# Altium schematic sheet PCB_Controller.SchDoc
size A3; DocumentNumber: 8; SheetNumber: 8; SheetTotal: 8
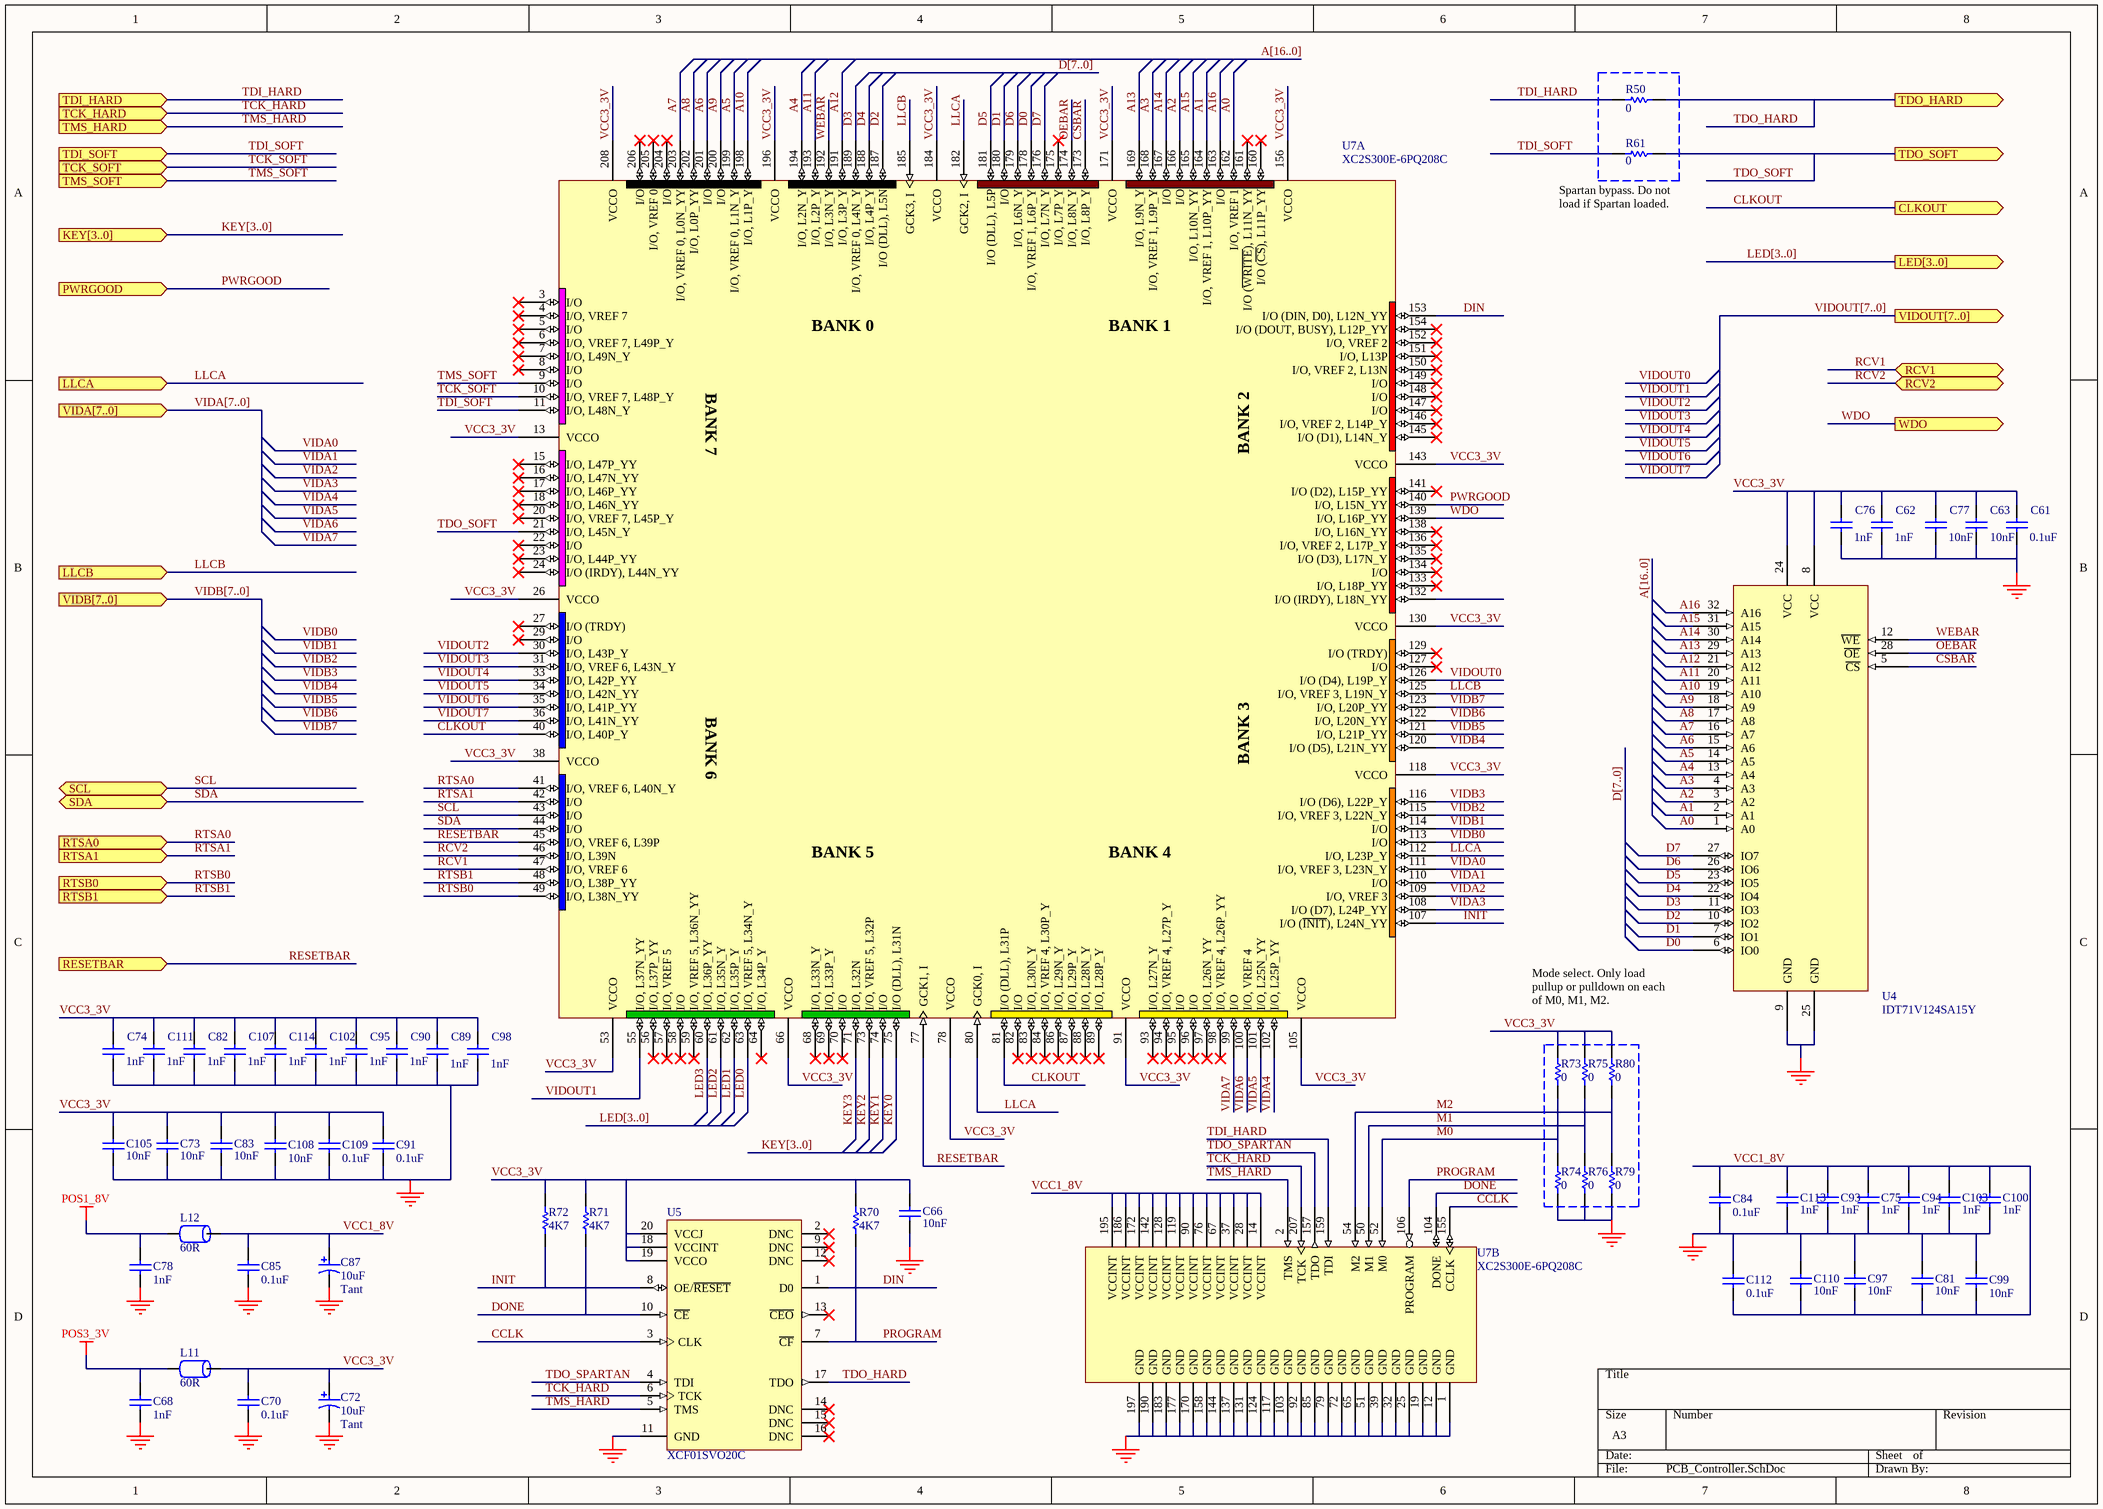
[diagram p0: PCB_Controller.SchDoc]

## Parts
C61  0.1uF  [CC2012-0805]
C62  1nF  [CC2012-0805]
C63  10nF  [CC2012-0805]
C66  10nF  [CC2012-0805]
C68  1nF  [CC2012-0805]
C70  0.1uF  [CC2012-0805]
C72  10uF  Capacitor Type: Tant  [MCCT-B]
C73  10nF  [CC2012-0805]
C74  1nF  [CC2012-0805]
C75  1nF  [CC2012-0805]
C76  1nF  [CC2012-0805]
C77  10nF  [CC2012-0805]
C78  1nF  [CC2012-0805]
C81  10nF  [CC2012-0805]
C82  1nF  [CC2012-0805]
C83  10nF  [CC2012-0805]
C84  0.1uF  [CC2012-0805]
C85  0.1uF  [CC2012-0805]
C87  10uF  Capacitor Type: Tant  [MCCT-B]
C89  1nF  [CC2012-0805]
C90  1nF  [CC2012-0805]
C91  0.1uF  [CC2012-0805]
C93  1nF  [CC2012-0805]
C94  1nF  [CC2012-0805]
C95  1nF  [CC2012-0805]
C97  10nF  [CC2012-0805]
C98  1nF  [CC2012-0805]
C99  10nF  [CC2012-0805]
C100  1nF  [CC2012-0805]
C102  1nF  [CC2012-0805]
C103  1nF  [CC2012-0805]
C105  10nF  [CC2012-0805]
C107  1nF  [CC2012-0805]
C108  10nF  [CC2012-0805]
C109  0.1uF  [CC2012-0805]
C110  10nF  [CC2012-0805]
C111  1nF  [CC2012-0805]
C112  0.1uF  [CC2012-0805]
C113  1nF  [CC2012-0805]
C114  1nF  [CC2012-0805]
L11  60R  [CC2012-0805]
L12  60R  [CC2012-0805]
R50  0  [CC2012-0805]
R61  0  [CC2012-0805]
R70  4K7  [CC2012-0805]
R71  4K7  [CC2012-0805]
R72  4K7  [CC2012-0805]
R73  0  [CC2012-0805]
R74  0  [CC2012-0805]
R75  0  [CC2012-0805]
R76  0  [CC2012-0805]
R79  0  [CC2012-0805]
R80  0  [CC2012-0805]
U4  IDT71V124SA15Y  [SO-J32]
U5  XCF01SVO20C  [VO20]
U7  XC2S300E-6PQ208C  [F-QFP28X28-G208/P.5N]  (parts A,B of 2)

## Ports
CLKOUT (out), KEY[3..0] (in), LED[3..0] (out), LLCA (in), LLCB (in), PWRGOOD (in), RCV1 (bidir), RCV2 (bidir), RESETBAR (in), RTSA0 (in), RTSA1 (in), RTSB0 (in), RTSB1 (in), SCL (bidir), SDA (bidir), TCK_HARD (in), TCK_SOFT (in), TDI_HARD (in), TDI_SOFT (in), TDO_HARD (out), TDO_SOFT (out), TMS_HARD (in), TMS_SOFT (in), VIDA[7..0] (in), VIDB[7..0] (in), VIDOUT[7..0] (out), WDO (out)

## Nets
GND: C61.2 C62.2 C63.2 C66.2 C68.2 C70.2 C72.2 C73.2 C74.2 C75.2 C76.2 C77.2 C78.2 C81.1 C82.2 C83.2 C84.2 C85.2 C87.2 C89.2 C90.2 C91.2 C93.2 C94.2 C95.2 C97.1 C98.2 C99.1 C100.2 C102.2 C103.2 C105.2 C107.2 C108.2 C109.2 C110.1 C111.2 C112.1 C113.2 C114.2 R74.2 R76.2 R79.2 U4.9(GND) U4.25(GND) U5.11(GND) U7.1(GND) U7.12(GND) U7.19(GND) U7.25(GND) U7.32(GND) U7.39(GND) U7.51(GND) U7.65(GND) U7.72(GND) U7.79(GND) U7.85(GND) U7.92(GND) U7.103(GND) U7.117(GND) U7.124(GND) U7.131(GND) U7.137(GND) U7.144(GND) U7.158(GND) U7.170(GND) U7.177(GND) U7.183(GND) U7.190(GND) U7.197(GND)
POS1_8V: C78.1 L12.1
POS3_3V: C68.1 L11.1
A0: U4.1(A0) U7.162(I/O,_VREF_1)
A1: U4.2(A1) U7.164(I/O,_VREF_1,_L10P_YY)
A2: U4.3(A2) U7.166(I/O)
A3: U4.4(A3) U7.168(I/O,_VREF_1,_L9P_Y)
A4: U4.13(A4) U7.194(I/O,_L2N_Y)
A5: U4.14(A5) U7.199(I/O,_VREF_0,_L1N_Y)
A6: U4.15(A6) U7.201(I/O)
A7: U4.16(A7) U7.203(I/O,_VREF_0,_L0N_YY)
A8: U4.17(A8) U7.202(I/O,_L0P_YY)
A9: U4.18(A9) U7.200(I/O)
A10: U4.19(A10) U7.198(I/O,_L1P_Y)
A11: U4.20(A11) U7.193(I/O,_L2P_Y)
A12: U4.21(A12) U7.191(I/O,_L3P_Y)
A13: U4.29(A13) U7.169(I/O,_L9N_Y)
A14: U4.30(A14) U7.167(I/O)
A15: U4.31(A15) U7.165(I/O,_L10N_YY)
A16: U4.32(A16) U7.163(I/O)
CCLK: U5.3(CLK) U7.155(CCLK)
CLKOUT: U7.40(I/O,_L40P_Y) U7.81(I/O_(DLL),_L31P) ; port CLKOUT
CSBAR: U4.5(~{CS}) U7.173(I/O,_L8P_Y)
D0: U4.6(IO0) U7.178(I/O,_VREF_1,_L6P_Y)
D1: U4.7(IO1) U7.180(I/O)
D2: U4.10(IO2) U7.187(I/O_(DLL),_L5N)
D3: U4.11(IO3) U7.189(I/O,_VREF_0,_L4N_Y)
D4: U4.22(IO4) U7.188(I/O,_L4P_Y)
D5: U4.23(IO5) U7.181(I/O_(DLL),_L5P)
D6: U4.26(IO6) U7.179(I/O,_L6N_Y)
D7: U4.27(IO7) U7.176(I/O,_L7N_Y)
DIN: U5.1(D0) U7.153(I/O_(DIN,_D0),_L12N_YY)
DONE: R71.2 U5.10(~{CE}) U7.104(DONE)
INIT: R72.2 U5.8(OE/~{RESET}) U7.107(I/O_(~{INIT}),_L24N_YY)
KEY0: U7.75(I/O_(DLL),_L31N)
KEY1: U7.74(I/O)
KEY2: U7.73(I/O,_VREF_5,_L32P)
KEY3: U7.71(I/O,_L32N)
LED0: U7.63(I/O,_VREF_5,_L34N_Y)
LED1: U7.62(I/O,_L35P_Y)
LED2: U7.61(I/O,_L35N_Y)
LED3: U7.60(I/O,_L36P_YY)
LLCA: U7.80(GCK0,_I) U7.112(I/O,_L23P_Y) U7.182(GCK2,_I) ; port LLCA
LLCB: U7.125(I/O,_VREF_3,_L19N_Y) U7.185(GCK3,_I) ; port LLCB
M0: R73.2 R74.1 U7.52(M0)
M1: R75.2 R76.1 U7.50(M1)
M2: R79.1 R80.2 U7.54(M2)
OEBAR: U4.28(~{OE}) U7.174(I/O,_L8N_Y)
PROGRAM: R70.2 U5.7(~{CF}) U7.106(PROGRAM)
PWRGOOD: U7.140(I/O,_L15N_YY) ; port PWRGOOD
RCV1: U7.47(I/O,_VREF_6) ; port RCV1
RCV2: U7.46(I/O,_L39N) ; port RCV2
RESETBAR: U7.45(I/O,_VREF_6,_L39P) U7.77(GCK1,_I) ; port RESETBAR
RTSA0: U7.41(I/O,_VREF_6,_L40N_Y) ; port RTSA0
RTSA1: U7.42(I/O) ; port RTSA1
RTSB0: U7.49(I/O,_L38N_YY) ; port RTSB0
RTSB1: U7.48(I/O,_L38P_YY) ; port RTSB1
SCL: U7.43(I/O) ; port SCL
SDA: U7.44(I/O) ; port SDA
TCK_HARD: U5.6(TCK) U7.207(TCK) ; port TCK_HARD
TCK_SOFT: U7.10(I/O,_VREF_7,_L48P_Y) ; port TCK_SOFT
TDI_HARD: R50.1 U7.159(TDI) ; port TDI_HARD
TDI_SOFT: R61.1 U7.11(I/O,_L48N_Y) ; port TDI_SOFT
TDO_HARD: R50.2 U5.17(TDO) ; port TDO_HARD
TDO_SOFT: R61.2 U7.21(I/O,_L45N_Y) ; port TDO_SOFT
TDO_SPARTAN: U5.4(TDI) U7.157(TDO)
TMS_HARD: U5.5(TMS) U7.2(TMS) ; port TMS_HARD
TMS_SOFT: U7.9(I/O) ; port TMS_SOFT
VCC1_8V: C75.1 C81.2 C84.1 C85.1 C87.1 C93.1 C94.1 C97.2 C99.2 C100.1 C103.1 C110.2 C112.2 C113.1 L12.2 U7.14(VCCINT) U7.28(VCCINT) U7.37(VCCINT) U7.67(VCCINT) U7.76(VCCINT) U7.90(VCCINT) U7.119(VCCINT) U7.128(VCCINT) U7.142(VCCINT) U7.172(VCCINT) U7.186(VCCINT) U7.195(VCCINT)
VCC3_3V: C61.1 C62.1 C63.1 C66.1 C70.1 C72.1 C73.1 C74.1 C76.1 C77.1 C82.1 C83.1 C89.1 C90.1 C91.1 C95.1 C98.1 C102.1 C105.1 C107.1 C108.1 C109.1 C111.1 C114.1 L11.2 R70.1 R71.1 R72.1 R73.1 R75.1 R80.1 U4.8(VCC) U4.24(VCC) U5.18(VCCINT) U5.19(VCCO) U5.20(VCCJ) U7.13(VCCO) U7.26(VCCO) U7.38(VCCO) U7.53(VCCO) U7.66(VCCO) U7.78(VCCO) U7.91(VCCO) U7.105(VCCO) U7.118(VCCO) U7.130(VCCO) U7.143(VCCO) U7.156(VCCO) U7.171(VCCO) U7.184(VCCO) U7.196(VCCO) U7.208(VCCO)
VIDA0: U7.111(I/O,_VREF_3,_L23N_Y)
VIDA1: U7.110(I/O)
VIDA2: U7.109(I/O,_VREF_3)
VIDA3: U7.108(I/O_(D7),_L24P_YY)
VIDA4: U7.102(I/O,_L25P_YY)
VIDA5: U7.101(I/O,_L25N_YY)
VIDA6: U7.100(I/O,_VREF_4)
VIDA7: U7.99(I/O)
VIDB0: U7.113(I/O)
VIDB1: U7.114(I/O)
VIDB2: U7.115(I/O,_VREF_3,_L22N_Y)
VIDB3: U7.116(I/O_(D6),_L22P_Y)
VIDB4: U7.120(I/O_(D5),_L21N_YY)
VIDB5: U7.121(I/O,_L21P_YY)
VIDB6: U7.122(I/O,_L20N_YY)
VIDB7: U7.123(I/O,_L20P_YY)
VIDOUT0: U7.126(I/O_(D4),_L19P_Y)
VIDOUT1: U7.55(I/O,_L37N_YY)
VIDOUT2: U7.30(I/O,_L43P_Y)
VIDOUT3: U7.31(I/O,_VREF_6,_L43N_Y)
VIDOUT4: U7.33(I/O,_L42P_YY)
VIDOUT5: U7.34(I/O,_L42N_YY)
VIDOUT6: U7.35(I/O,_L41P_YY)
VIDOUT7: U7.36(I/O,_L41N_YY)
WDO: U7.139(I/O,_L16P_YY) ; port WDO
WEBAR: U4.12(~{WE}) U7.192(I/O,_L3N_Y)

Not connected (* = marked no-connect by the designer): U5 2(DNC)* 9(DNC)* 12(DNC)* 13(~{CEO})* 14(DNC)* 15(DNC)* 16(DNC)*; U7 3(I/O)* 4(I/O,_VREF_7)* 5(I/O)* 6(I/O,_VREF_7,_L49P_Y)* 7(I/O,_L49N_Y)* 8(I/O)* 15(I/O,_L47P_YY)* 16(I/O,_L47N_YY)* 17(I/O,_L46P_YY)* 18(I/O,_L46N_YY)* 20(I/O,_VREF_7,_L45P_Y)* 22(I/O)* 23(I/O,_L44P_YY)* 24(I/O_(IRDY),_L44N_YY)* 27(I/O_(TRDY))* 29(I/O)* 56(I/O,_L37P_YY)* 57(I/O,_VREF_5)* 58(I/O)* 59(I/O,_VREF_5,_L36N_YY)* 64(I/O,_L34P_Y)* 68(I/O,_L33N_Y)* 69(I/O,_L33P_Y)* 70(I/O)* 82(I/O)* 83(I/O,_L30N_Y)* 84(I/O,_VREF_4,_L30P_Y)* 86(I/O,_L29N_Y)* 87(I/O,_L29P_Y)* 88(I/O,_L28N_Y)* 89(I/O,_L28P_Y)* 93(I/O,_L27N_Y)* 94(I/O,_VREF_4,_L27P_Y)* 95(I/O)* 96(I/O)* 97(I/O,_L26N_YY)* 98(I/O,_VREF_4,_L26P_YY)* 127(I/O)* 129(I/O_(TRDY))* 132(I/O_(IRDY),_L18N_YY) 133(I/O,_L18P_YY)* 134(I/O)* 135(I/O_(D3),_L17N_Y)* 136(I/O,_VREF_2,_L17P_Y)* 138(I/O,_L16N_YY)* 141(I/O_(D2),_L15P_YY)* 145(I/O_(D1),_L14N_Y)* 146(I/O,_VREF_2,_L14P_Y)* 147(I/O)* 148(I/O)* 149(I/O)* 150(I/O,_VREF_2,_L13N)* 151(I/O,_L13P)* 152(I/O,_VREF_2)* 154(I/O_(DOUT,_BUSY),_L12P_YY)* 160(I/O_(~{CS}),_L11P_YY)* 161(I/O_(~{WRITE}),_L11N_YY)* 175(I/O,_L7P_Y)* 204(I/O)* 205(I/O,_VREF_0)* 206(I/O)*

## Buses and harness runs
bus A[16..0]
bus D[7..0]
bus KEY[3..0]
bus KEY[3..0] = port KEY[3..0]
bus LED[3..0]
bus LED[3..0] = port LED[3..0]
bus VIDA[7..0] = port VIDA[7..0]
bus VIDB[7..0] = port VIDB[7..0]
bus VIDOUT[7..0] = port VIDOUT[7..0]

## Notes on the sheet
- (near R61) Spartan bypass. Do not load if Spartan loaded.
- Mode select. Only load pullup or pulldown on each of M0, M1, M2.
- (in symbol XC2S300E-6PQ208C, part A) BANK 0; BANK 1; BANK 7; BANK 2; BANK 6; BANK 3; BANK 5; BANK 4

## Library data of the parts
C61-C63 C66 C68 C70 C73-C78 C81-C85 C89-C91 C93-C95 C97-C100 C102 C103 C105 C107-C114 = CAP: Capacitor; Fitted: True
C72 C87 = CAP_POLAR: Polar Capacitor; Fitted: True
L11 L12 = FERRITE_BEAD: BMB Series Ferrite Chip Bead
R50 R61 R70-R76 R79 R80 = RES: Resistor; Fitted: True
U4 = IDT71V124SA15Y: 128K x 8 bit Fast Static RAM; Fitted: True; Supplier: IDT
U5 = XCF01SVO20C: XCF00S Series, Platform Flash In-System Programmable Configuration 3.3V PROM, 1-Megabit, Commercial Grade; Manufacturer: Xilinx; Package Information: Latest Revision: ver1.0, May-2003; Class I: Memory; Code - JEDEC: MO-153-AC; Fitted: True; Published: 20-Aug-2003; Datasheet: Latest Revision: ver1.1, June-2003; Package Reference: VO20; Publisher: Altium Limited; Class II: PROM
U7 = XC2S300E-6PQ208C: Spartan-IIE 1.8V FPGA, 208-Pin PQFP, Standard Performance, Commercial Grade; Package Information: Latest Revision: ver1.1, Oct-2002; Code - JEDEC: MS-029-FA-1; Published: 19-Jul-2002; Revision: 17-Sep-2003: Pin names updated to match datasheet, ver2.1.; Datasheet: Latest Revision: 09-Jul-2003; Package Reference: PQ208; Publisher: Altium Limited